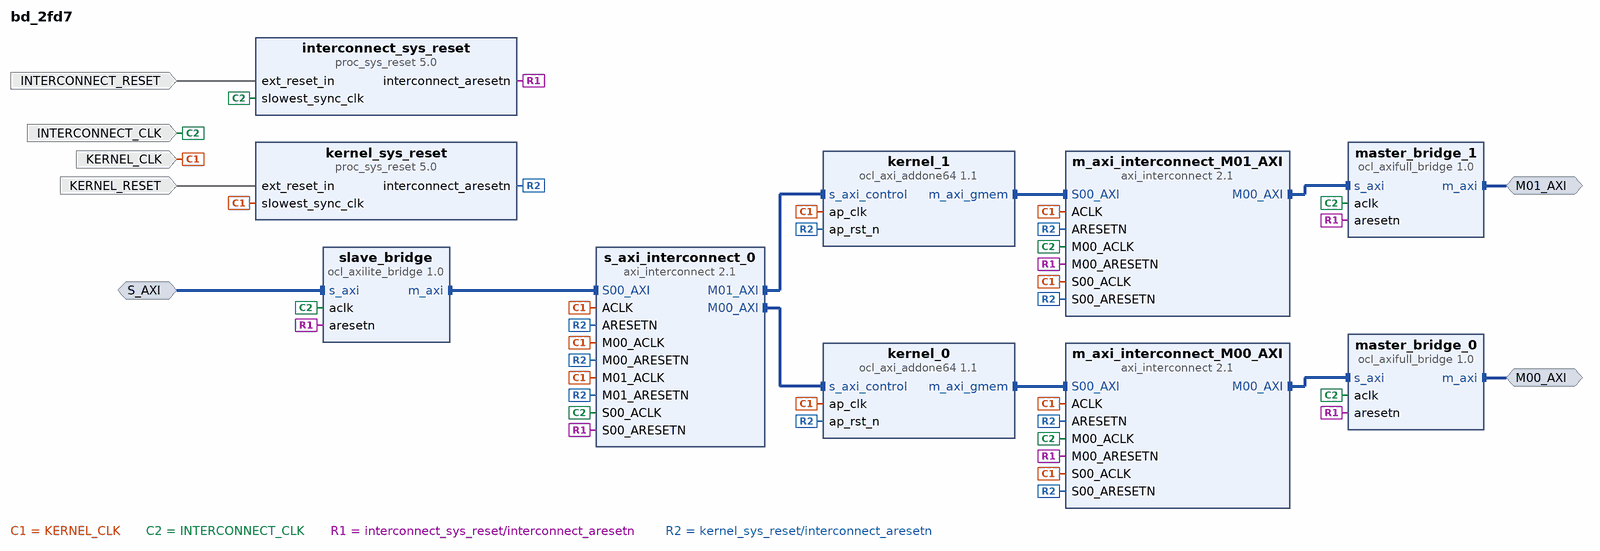
[diagram p0: block diagram of the top level]
# Vivado block design bd_2fd7, xcku060-ffva1156-2-e, Vivado 2016.3_sdx
create_bd_design bd_2fd7

create_bd_intf_port -mode Master -vlnv xilinx.com:interface:aximm_rtl:1.0 M00_AXI
set_property -dict [list \
  CONFIG.DATA_WIDTH 512 \
  CONFIG.PROTOCOL AXI4 \
  CONFIG.ID_WIDTH 4 \
  CONFIG.ADDR_WIDTH 38 \
  CONFIG.NUM_READ_OUTSTANDING 8 \
  CONFIG.NUM_WRITE_OUTSTANDING 8 \
] [get_bd_intf_ports M00_AXI]
create_bd_intf_port -mode Master -vlnv xilinx.com:interface:aximm_rtl:1.0 M01_AXI
set_property -dict [list \
  CONFIG.DATA_WIDTH 512 \
  CONFIG.PROTOCOL AXI4 \
  CONFIG.ID_WIDTH 4 \
  CONFIG.ADDR_WIDTH 38 \
  CONFIG.NUM_READ_OUTSTANDING 8 \
  CONFIG.NUM_WRITE_OUTSTANDING 8 \
] [get_bd_intf_ports M01_AXI]
create_bd_intf_port -mode Slave -vlnv xilinx.com:interface:aximm_rtl:1.0 S_AXI
set_property -dict [list \
  CONFIG.DATA_WIDTH 32 \
  CONFIG.PROTOCOL AXI4LITE \
  CONFIG.ADDR_WIDTH 17 \
  CONFIG.SUPPORTS_NARROW_BURST 0 \
  CONFIG.NUM_READ_OUTSTANDING 1 \
  CONFIG.NUM_WRITE_OUTSTANDING 1 \
  CONFIG.MAX_BURST_LENGTH 1 \
] [get_bd_intf_ports S_AXI]
create_bd_port -dir I -type clk KERNEL_CLK
set_property -dict {CONFIG.ASSOCIATED_RESET KERNEL_RESET} [get_bd_ports KERNEL_CLK]
create_bd_port -dir I -type rst KERNEL_RESET
create_bd_port -dir I -type clk INTERCONNECT_CLK
set_property -dict [list \
  CONFIG.ASSOCIATED_BUSIF M00_AXI:M01_AXI:S_AXI \
  CONFIG.ASSOCIATED_RESET INTERCONNECT_RESET \
] [get_bd_ports INTERCONNECT_CLK]
create_bd_port -dir I -type rst INTERCONNECT_RESET

create_bd_cell -type ip -vlnv xilinx.com:ip:axi_interconnect:2.1 m_axi_interconnect_M00_AXI
set_property -dict [list \
  CONFIG.NUM_SI 1 \
  CONFIG.NUM_MI 1 \
  CONFIG.XBAR_DATA_WIDTH 512 \
  CONFIG.S00_HAS_REGSLICE 4 \
] [get_bd_cells m_axi_interconnect_M00_AXI]
create_bd_cell -type ip -vlnv xilinx.com:ip:axi_interconnect:2.1 m_axi_interconnect_M01_AXI
set_property -dict [list \
  CONFIG.NUM_SI 1 \
  CONFIG.NUM_MI 1 \
  CONFIG.XBAR_DATA_WIDTH 512 \
  CONFIG.S00_HAS_REGSLICE 4 \
] [get_bd_cells m_axi_interconnect_M01_AXI]
create_bd_cell -type ip -vlnv xilinx.com:ip:axi_interconnect:2.1 s_axi_interconnect_0
set_property -dict [list \
  CONFIG.NUM_SI 1 \
  CONFIG.NUM_MI 2 \
  CONFIG.XBAR_DATA_WIDTH 32 \
  CONFIG.M00_HAS_REGSLICE 4 \
  CONFIG.M01_HAS_REGSLICE 4 \
] [get_bd_cells s_axi_interconnect_0]
create_bd_cell -type ip -vlnv xilinx.com:ip:proc_sys_reset:5.0 interconnect_sys_reset
create_bd_cell -type ip -vlnv xilinx.com:ip:proc_sys_reset:5.0 kernel_sys_reset
create_bd_cell -type ip -vlnv xilinx.com:ip:ocl_axi_addone64:1.1 kernel_0
set_property -dict [list \
  CONFIG.C_M_AXI_GMEM_DATA_WIDTH 512 \
  CONFIG.C_M_AXI_GMEM_ADDR_WIDTH 38 \
  CONFIG.HAS_BURST 0 \
] [get_bd_cells kernel_0]
create_bd_cell -type ip -vlnv xilinx.com:ip:ocl_axi_addone64:1.1 kernel_1
set_property -dict [list \
  CONFIG.C_M_AXI_GMEM_DATA_WIDTH 512 \
  CONFIG.C_M_AXI_GMEM_ADDR_WIDTH 38 \
  CONFIG.HAS_BURST 0 \
] [get_bd_cells kernel_1]
create_bd_cell -type ip -vlnv xilinx.com:ip:ocl_axilite_bridge:1.0 slave_bridge
set_property -dict {CONFIG.DATA_WIDTH 32 CONFIG.ADDR_WIDTH 17 CONFIG.HAS_BURST 0} [get_bd_cells slave_bridge]
create_bd_cell -type ip -vlnv xilinx.com:ip:ocl_axifull_bridge:1.0 master_bridge_0
set_property -dict [list \
  CONFIG.DATA_WIDTH 512 \
  CONFIG.S_ID_WIDTH 1 \
  CONFIG.M_ID_WIDTH 4 \
  CONFIG.ADDR_WIDTH 38 \
  CONFIG.HAS_SLAVE_ID true \
  CONFIG.HAS_BURST 0 \
] [get_bd_cells master_bridge_0]
create_bd_cell -type ip -vlnv xilinx.com:ip:ocl_axifull_bridge:1.0 master_bridge_1
set_property -dict [list \
  CONFIG.DATA_WIDTH 512 \
  CONFIG.S_ID_WIDTH 1 \
  CONFIG.M_ID_WIDTH 4 \
  CONFIG.ADDR_WIDTH 38 \
  CONFIG.HAS_SLAVE_ID true \
  CONFIG.HAS_BURST 0 \
] [get_bd_cells master_bridge_1]

# ---- connections ----

connect_bd_intf_net [get_bd_intf_pins s_axi_interconnect_0/M00_AXI] [get_bd_intf_pins kernel_0/s_axi_control]
connect_bd_intf_net [get_bd_intf_pins kernel_0/m_axi_gmem] [get_bd_intf_pins m_axi_interconnect_M00_AXI/S00_AXI]
connect_bd_intf_net [get_bd_intf_pins s_axi_interconnect_0/M01_AXI] [get_bd_intf_pins kernel_1/s_axi_control]
connect_bd_intf_net [get_bd_intf_pins kernel_1/m_axi_gmem] [get_bd_intf_pins m_axi_interconnect_M01_AXI/S00_AXI]
connect_bd_intf_net [get_bd_intf_pins slave_bridge/m_axi] [get_bd_intf_pins s_axi_interconnect_0/S00_AXI]
connect_bd_intf_net [get_bd_intf_pins m_axi_interconnect_M00_AXI/M00_AXI] [get_bd_intf_pins master_bridge_0/s_axi]
connect_bd_intf_net [get_bd_intf_pins m_axi_interconnect_M01_AXI/M00_AXI] [get_bd_intf_pins master_bridge_1/s_axi]
connect_bd_intf_net [get_bd_intf_ports M00_AXI] [get_bd_intf_pins master_bridge_0/m_axi]
connect_bd_intf_net [get_bd_intf_ports M01_AXI] [get_bd_intf_pins master_bridge_1/m_axi]
connect_bd_intf_net [get_bd_intf_ports S_AXI] [get_bd_intf_pins slave_bridge/s_axi]
connect_bd_net [get_bd_ports KERNEL_CLK] \
  [get_bd_pins kernel_sys_reset/slowest_sync_clk] [get_bd_pins kernel_0/ap_clk] [get_bd_pins kernel_1/ap_clk] \
  [get_bd_pins s_axi_interconnect_0/ACLK] [get_bd_pins s_axi_interconnect_0/M00_ACLK] \
  [get_bd_pins s_axi_interconnect_0/M01_ACLK] [get_bd_pins m_axi_interconnect_M00_AXI/ACLK] \
  [get_bd_pins m_axi_interconnect_M00_AXI/S00_ACLK] [get_bd_pins m_axi_interconnect_M01_AXI/ACLK] \
  [get_bd_pins m_axi_interconnect_M01_AXI/S00_ACLK]
connect_bd_net [get_bd_ports KERNEL_RESET] [get_bd_pins kernel_sys_reset/ext_reset_in]
connect_bd_net [get_bd_ports INTERCONNECT_CLK] \
  [get_bd_pins interconnect_sys_reset/slowest_sync_clk] [get_bd_pins slave_bridge/aclk] [get_bd_pins master_bridge_0/aclk] \
  [get_bd_pins master_bridge_1/aclk] [get_bd_pins s_axi_interconnect_0/S00_ACLK] \
  [get_bd_pins m_axi_interconnect_M00_AXI/M00_ACLK] [get_bd_pins m_axi_interconnect_M01_AXI/M00_ACLK]
connect_bd_net [get_bd_ports INTERCONNECT_RESET] [get_bd_pins interconnect_sys_reset/ext_reset_in]
connect_bd_net -net INTERCONNECT_RESET_sync [get_bd_pins interconnect_sys_reset/interconnect_aresetn] \
  [get_bd_pins slave_bridge/aresetn] [get_bd_pins master_bridge_0/aresetn] [get_bd_pins master_bridge_1/aresetn] \
  [get_bd_pins s_axi_interconnect_0/S00_ARESETN] [get_bd_pins m_axi_interconnect_M00_AXI/M00_ARESETN] \
  [get_bd_pins m_axi_interconnect_M01_AXI/M00_ARESETN]
connect_bd_net -net KERNEL_RESET_sync [get_bd_pins kernel_sys_reset/interconnect_aresetn] \
  [get_bd_pins kernel_0/ap_rst_n] [get_bd_pins kernel_1/ap_rst_n] [get_bd_pins s_axi_interconnect_0/ARESETN] \
  [get_bd_pins s_axi_interconnect_0/M00_ARESETN] [get_bd_pins s_axi_interconnect_0/M01_ARESETN] \
  [get_bd_pins m_axi_interconnect_M00_AXI/ARESETN] [get_bd_pins m_axi_interconnect_M00_AXI/S00_ARESETN] \
  [get_bd_pins m_axi_interconnect_M01_AXI/ARESETN] [get_bd_pins m_axi_interconnect_M01_AXI/S00_ARESETN]

# ---- address map ----
assign_bd_address -offset 0x0000000000 -range 256G -target_address_space [get_bd_addr_spaces kernel_0/Data_m_axi_gmem] [get_bd_addr_segs M00_AXI/Reg]
assign_bd_address -offset 0x0000000000 -range 256G -target_address_space [get_bd_addr_spaces kernel_1/Data_m_axi_gmem] [get_bd_addr_segs M01_AXI/Reg]
assign_bd_address -offset 0x00000 -range 64K -target_address_space [get_bd_addr_spaces S_AXI] [get_bd_addr_segs kernel_0/s_axi_control/Reg]
assign_bd_address -offset 0x10000 -range 64K -target_address_space [get_bd_addr_spaces S_AXI] [get_bd_addr_segs kernel_1/s_axi_control/Reg]

validate_bd_design
save_bd_design
